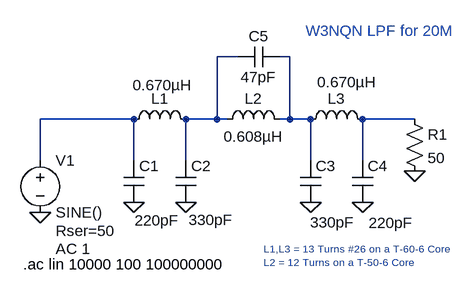
[diagram p0: schematic P3ST_W3NQN_20M_LPF.asc]
P3ST_W3NQN_20M_LPF.asc, the LTspice schematic file:
Version 4
SHEET 1 880 680
WIRE 240 80 208 80
WIRE 320 80 304 80
WIRE 80 176 -64 176
WIRE 208 176 208 80
WIRE 208 176 160 176
WIRE 224 176 208 176
WIRE 320 176 320 80
WIRE 320 176 304 176
WIRE 352 176 320 176
WIRE 512 176 432 176
WIRE -64 240 -64 176
WIRE 80 240 80 176
WIRE 160 240 160 176
WIRE 352 240 352 176
WIRE 432 240 432 176
FLAG 80 304 0
FLAG 160 304 0
FLAG 352 304 0
FLAG 432 304 0
FLAG -64 320 0
FLAG 512 256 0
SYMBOL ind 64 192 R270
WINDOW 0 32 56 VTop 2
WINDOW 3 84 60 VBottom 2
SYMATTR InstName L1
SYMATTR Value 0.670µH
SYMBOL ind 208 192 R270
WINDOW 0 32 56 VTop 2
WINDOW 3 5 56 VBottom 2
SYMATTR InstName L2
SYMATTR Value 0.608µH
SYMBOL ind 336 192 R270
WINDOW 0 32 56 VTop 2
WINDOW 3 89 72 VBottom 2
SYMATTR InstName L3
SYMATTR Value 0.670µH
SYMBOL cap 64 240 R0
WINDOW 3 17 92 Left 2
SYMATTR InstName C1
SYMATTR Value 220pF
SYMBOL cap 144 240 R0
WINDOW 3 20 91 Left 2
SYMATTR InstName C2
SYMATTR Value 330pF
SYMBOL cap 336 240 R0
WINDOW 3 15 95 Left 2
SYMATTR InstName C3
SYMATTR Value 330pF
SYMBOL cap 416 240 R0
WINDOW 3 25 96 Left 2
SYMATTR InstName C4
SYMATTR Value 220pF
SYMBOL cap 304 64 R90
WINDOW 0 0 32 VBottom 2
WINDOW 3 32 32 VTop 2
SYMATTR InstName C5
SYMATTR Value 47pF
SYMBOL voltage -64 224 R0
WINDOW 123 24 152 Left 2
WINDOW 39 24 124 Left 2
SYMATTR InstName V1
SYMATTR Value SINE()
SYMATTR Value2 AC 1
SYMATTR SpiceLine Rser=50
SYMBOL res 496 160 R0
SYMATTR InstName R1
SYMATTR Value 50
TEXT -90 400 Left 2 !.ac lin 10000 100 100000000
TEXT 280 376 Left 1 ;L1,L3 = 13 Turns #26 on a T-60-6 Core\nL2 = 12 Turns on a T-50-6 Core
TEXT 344 40 Left 2 ;W3NQN LPF for 20M

The netlist it stands for:
* P3ST_W3NQN_20M_LPF.asc
L1 N003 N001 0.670µH
L2 N001 N002 0.608µH
L3 N002 N004 0.670µH
C1 N003 0 220pF
C2 N001 0 330pF
C3 N002 0 330pF
C4 N004 0 220pF
C5 N002 N001 47pF
V1 N003 0 SINE() AC 1 Rser=50
R1 N004 0 50
.ac lin 10000 100 100000000
* L1,L3 = 13 Turns #26 on a T-60-6 Core
* L2 = 12 Turns on a T-50-6 Core
* W3NQN LPF for 20M
.backanno
.end